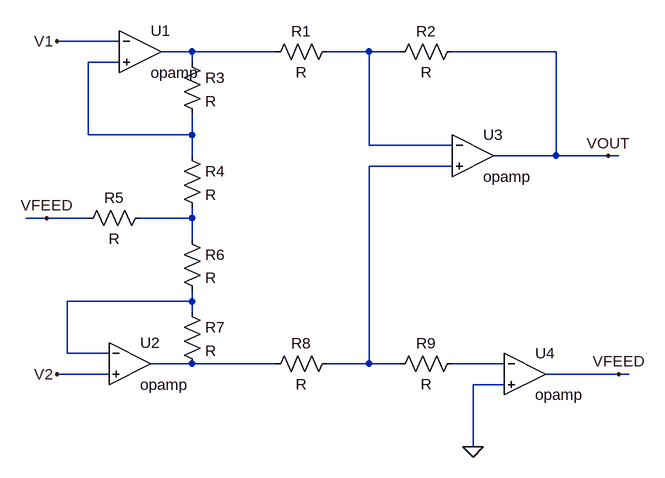
[diagram p0: schematic ej3_simulacion.asc]
ej3_simulacion.asc, the LTspice schematic file:
Version 4
SHEET 1 880 680
WIRE 48 0 -48 0
WIRE 160 16 112 16
WIRE 288 16 160 16
WIRE 432 16 368 16
WIRE 480 16 432 16
WIRE 720 16 560 16
WIRE 48 32 0 32
WIRE 160 32 160 16
WIRE 0 144 0 32
WIRE 160 144 160 112
WIRE 160 144 0 144
WIRE 432 160 432 16
WIRE 560 160 432 160
WIRE 160 176 160 144
WIRE 720 176 720 16
WIRE 720 176 624 176
WIRE 800 176 720 176
WIRE 816 176 800 176
WIRE 560 192 432 192
WIRE -64 272 -96 272
WIRE 0 272 -64 272
WIRE 160 272 160 256
WIRE 160 272 80 272
WIRE 160 304 160 272
WIRE 160 400 160 384
WIRE 160 400 -32 400
WIRE 160 416 160 400
WIRE -32 480 -32 400
WIRE 32 480 -32 480
WIRE 160 496 96 496
WIRE 288 496 160 496
WIRE 432 496 432 192
WIRE 432 496 368 496
WIRE 480 496 432 496
WIRE 640 496 560 496
WIRE 32 512 -48 512
WIRE 816 512 704 512
WIRE 832 512 816 512
WIRE 640 528 592 528
WIRE 592 624 592 528
FLAG -48 0 V1
FLAG -48 512 V2
FLAG 816 512 VFEED
FLAG -64 272 VFEED
FLAG 800 176 VOUT
FLAG 592 624 0
SYMBOL Opamps\\opamp 80 -48 R0
SYMATTR InstName U1
SYMBOL Opamps\\opamp 64 432 R0
SYMATTR InstName U2
SYMBOL res 144 16 R0
SYMATTR InstName R3
SYMBOL res 144 160 R0
SYMATTR InstName R4
SYMBOL res 144 288 R0
SYMATTR InstName R6
SYMBOL res 144 400 R0
SYMATTR InstName R7
SYMBOL res 384 0 R90
WINDOW 0 0 56 VBottom 2
WINDOW 3 32 56 VTop 2
SYMATTR InstName R1
SYMBOL res 384 480 R90
WINDOW 0 0 56 VBottom 2
WINDOW 3 32 56 VTop 2
SYMATTR InstName R8
SYMBOL res 576 0 R90
WINDOW 0 0 56 VBottom 2
WINDOW 3 32 56 VTop 2
SYMATTR InstName R2
SYMBOL res 576 480 R90
WINDOW 0 0 56 VBottom 2
WINDOW 3 32 56 VTop 2
SYMATTR InstName R9
SYMBOL Opamps\\opamp 592 112 R0
SYMATTR InstName U3
SYMBOL Opamps\\opamp 672 448 R0
SYMATTR InstName U4
SYMBOL res 96 256 R90
WINDOW 0 0 56 VBottom 2
WINDOW 3 32 56 VTop 2
SYMATTR InstName R5

The netlist it stands for:
* ej3_simulacion.asc
XU1 V1 N003 N001 opamp Aol=100K GBW=10Meg  ; pins invin noninvin out
XU2 N006 V2 N007 opamp Aol=100K GBW=10Meg  ; pins invin noninvin out
R3 N001 N003 R
R4 N003 N005 R
R6 N005 N006 R
R7 N006 N007 R
R1 N002 N001 R
R8 N004 N007 R
R2 VOUT N002 R
R9 N008 N004 R
XU3 N002 N004 VOUT opamp Aol=100K GBW=10Meg  ; pins invin noninvin out
XU4 N008 0 VFEED opamp Aol=100K GBW=10Meg  ; pins invin noninvin out
R5 N005 VFEED R
.backanno
.end